# EAGLE schematic rc_controller_transmitter_comp (EAGLE 9.6.2)
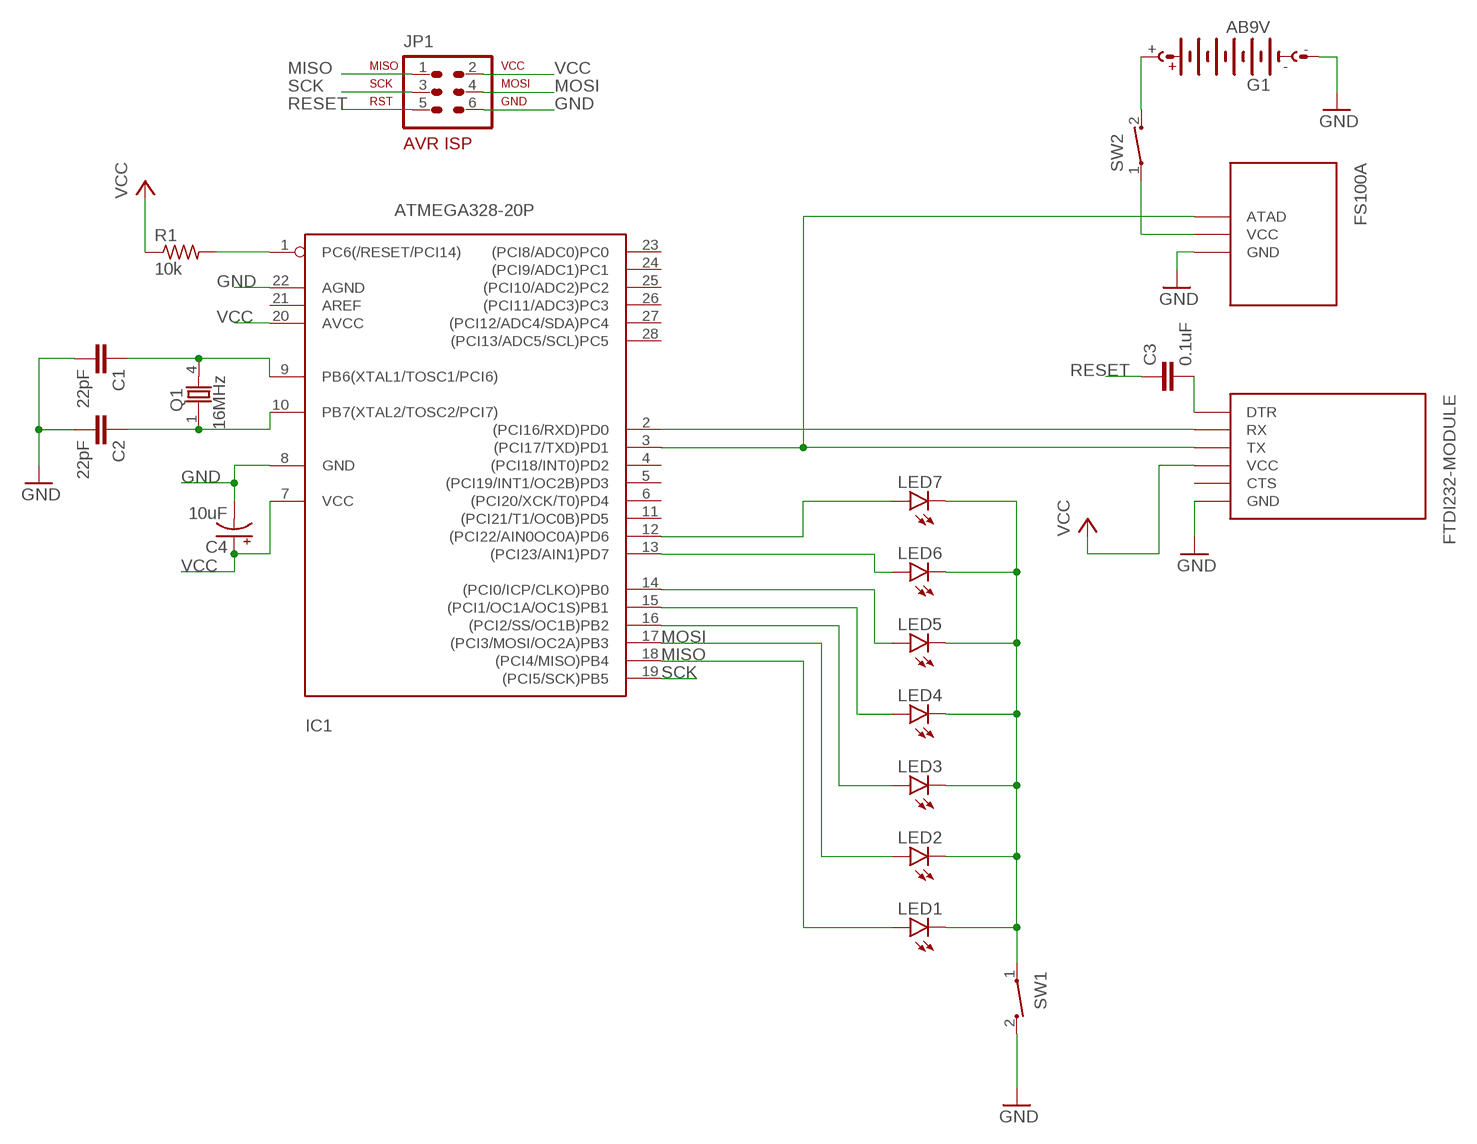
[diagram p0: schematic, sheet 1]

## Parts
C1  22pF  C2,5-3  [C2.5-3]
C2  22pF  C2,5-3  [C2.5-3]
C3  0.1uF  C2,5-3  [C2.5-3]
C4  10uF  CPOL-US085CS-1AW  [085CS_1AW]
G1  AB9V  [AB9V]
IC1  ATMEGA328-20P  [DIL28-3]
JP1  AVR-ISP-6VERT  [AVR-ISP-6]
LED1  LEDLUMILED  [LUMILED]
LED2  LEDLUMILED  [LUMILED]
LED3  LEDLUMILED  [LUMILED]
LED4  LEDLUMILED  [LUMILED]
LED5  LEDLUMILED  [LUMILED]
LED6  LEDLUMILED  [LUMILED]
LED7  LEDLUMILED  [LUMILED]
Q1  16MHz  86SMX  [86SMX]
R1  10k  R-US_0204/7  [0204/7]
SW1  CT10-XXXX-A2  [CT10-XXXX-A2]
SW2  CT10-XXXX-A2  [CT10-XXXX-A2]
U$1  FS100A  (no package)
U$2  FTDI232-MODULE  (no package)

## Nets
GND: C1.2 C2.1 C2.2 C4.- G1.- IC1.8(GND) IC1.10(PB7(XTAL2/TOSC2/PCI7)) IC1.22(AGND) JP1.6 Q1.1 SW1.2 U$1.GND U$2.GND
MISO: IC1.18((PCI4/MISO)PB4) JP1.1 LED1.2+(A)
MOSI: IC1.17((PCI3/MOSI/OC2A)PB3) JP1.4 LED2.2+(A)
N$1: IC1.1(PC6(/RESET/PCI14)) R1.2
N$3: C1.1 IC1.9(PB6(XTAL1/TOSC1/PCI6)) Q1.4
N$4: C3.2 U$2.DTR
N$5: IC1.16((PCI2/SS/OC1B)PB2) LED3.2+(A)
N$6: IC1.13((PCI23/AIN1)PD7) LED6.2+(A)
N$7: IC1.14((PCI0/ICP/CLKO)PB0) LED5.2+(A)
N$8: SW2.1 U$1.VCC
N$9: IC1.3((PCI17/TXD)PD1) U$1.ATAD U$2.TX
N$10: IC1.2((PCI16/RXD)PD0) U$2.RX
N$11: G1.+ SW2.2
N$13: IC1.15((PCI1/OC1A/OC1S)PB1) LED4.2+(A)
N$14: IC1.12((PCI22/AIN0OC0A)PD6) LED7.2+(A)
N$15: LED1.4-(C) LED2.4-(C) LED3.4-(C) LED4.4-(C) LED5.4-(C) LED6.4-(C) LED7.4-(C) SW1.1
RESET: C3.1 JP1.5
SCK: IC1.19((PCI5/SCK)PB5) JP1.3
VCC: C4.+ IC1.7(VCC) IC1.20(AVCC) JP1.2 R1.1 U$2.VCC
Unconnected: IC1.4((PCI18/INT0)PD2) IC1.5((PCI19/INT1/OC2B)PD3) IC1.6((PCI20/XCK/T0)PD4) IC1.11((PCI21/T1/OC0B)PD5) IC1.21(AREF) IC1.23((PCI8/ADC0)PC0) IC1.24((PCI9/ADC1)PC1) IC1.25((PCI10/ADC2)PC2) IC1.26((PCI11/ADC3)PC3) IC1.27((PCI12/ADC4/SDA)PC4) IC1.28((PCI13/ADC5/SCL)PC5) U$2.CTS

## Library data of the parts
C1-C3 = capacitor-wima:C: CAPACITOR naming: grid - package width
C4 = rcl:CPOL-US: POLARIZED CAPACITOR, American symbol; SPICEPREFIX: C
G1 = battery:AB9V: 9-V BATTERY CLIP
IC1 = atmega328:ATMEGA328*P: MICROCONTROLLER 32 kBytes FLASH 2 kBytes SRAM 1 kBytes EEPROM USART 8-channel 10 bit ADC
JP1 = avr-7:AVR-ISP-6: AVR ISP-6 Serial Programming Header
LED1-LED7 = led-lumiled:LED: LED - LUMILED® LXK2-PW12-R00, LXK2-PW12-S00, LXK2-PW14-U00, LXK2-PW14-V00 LXK2-PM12-R00, LXK2-PM12-S00, LXK2-PM14-U00 LXK2-PE12-Q00, LXK2-PE12-R00, LXK2-PE12-S00, LXK2-PE14-T00, LXK2-PE14-U00 LXK2-PB12-K00, LXK2-PB12-L00, LXK2-PB12-M00, LXK2-PB14-N00, LXK2-PB14-P00, LXK2-PB14-Q00 LXK2-PR12-L00, LXK2-PR12-M00, LXK2-PR14-Q00, LXK2-PR14-R00 LXK2-PD12-Q00, LXK2-PD12-R00, LXK2-PD12-S00 LXK2-PH12-R00, LXK2-PH12-S00 LXK2-PL12-P00, LXK2-PL12-Q00, LXK2-PL12-R00 Source: www.luxeon.com; OC_FARNELL: unknown; OC_NEWARK: unknown
Q1 = crystal:86SMX: CRYSTAL; MF: C-MAC FREQUENCY PRODUCTS LTD; MPN: XTAL003321- 86SMX; OC_FARNELL: 6344914; OC_NEWARK: 01H9866
R1 = rcl:R-US_: RESISTOR, American symbol; SPICEPREFIX: R
SW1 SW2 = switch-coto:CT10-XXXX-: CT10 Series Molded Switch Source: www.cotorelay.com .. Coto_Technology__CT10-1530-G1.pdf
U$1 = mylibrary:FS100A
U$2 = mylibrary:FTDI232-MODULE